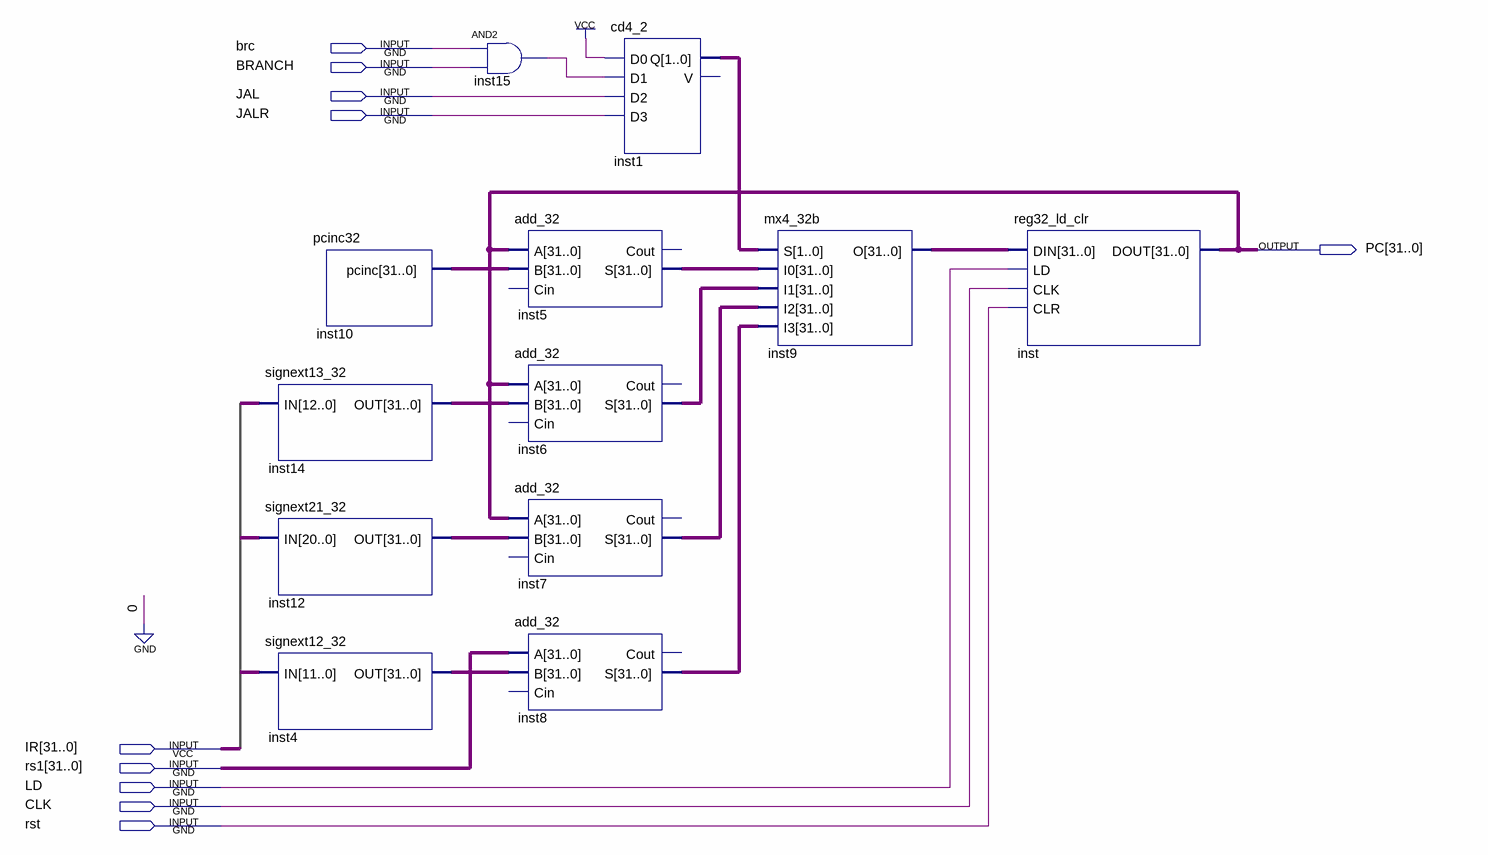
[diagram p0: schematic sheet]
// Quartus schematic pc.bdf as structural Verilog: 12 symbols, 10 pins
module pc (
  input  brc,
  input  BRANCH,
  input  JAL,
  input  JALR,
  input  [31:0] IR,
  input  [31:0] rs1,
  input  LD,
  input  CLK,
  input  rst,
  output [31:0] PC
);

  wire inst15_out;
  wire [1:0] inst1_q;
  wire [31:0] inst4_out, inst5_s, inst6_s, inst7_s, inst8_s, inst9_o, inst10_pcinc, inst12_out, inst14_out;

  signext13_32 inst14 (.IN({IR[31], IR[7], IR[30:25], IR[11:8], 1'b0}), .OUT(inst14_out));
  signext21_32 inst12 (.IN({IR[31], IR[19:12], IR[20], IR[30:21], 1'b0}), .OUT(inst12_out));
  signext12_32 inst4 (.IN(IR[31:20]), .OUT(inst4_out));
  pcinc32 inst10 (.pcinc(inst10_pcinc));
  and inst15 (inst15_out, brc, BRANCH);
  add_32 inst5 (.A(PC), .B(inst10_pcinc), .S(inst5_s));  // open: Cin, Cout
  add_32 inst6 (.A(PC), .B(inst14_out), .S(inst6_s));  // open: Cin, Cout
  add_32 inst7 (.A(PC), .B(inst12_out), .S(inst7_s));  // open: Cin, Cout
  add_32 inst8 (.A(rs1), .B(inst4_out), .S(inst8_s));  // open: Cin, Cout
  cd4_2 inst1 (.D0(1'b1), .D1(inst15_out), .D2(JAL), .D3(JALR), .Q(inst1_q));  // open: V
  mx4_32b inst9 (.S(inst1_q), .I0(inst5_s), .I1(inst6_s), .I2(inst7_s), .I3(inst8_s), .O(inst9_o));
  reg32_ld_clr inst (.DIN(inst9_o), .LD(LD), .CLK(CLK), .CLR(rst), .DOUT(PC));
endmodule
